# EasyEDA Pro project SimGEKI2_Core.epro, schematic Core New
Board Name: Core New Layout; Create Date: 2025-03-21; Page Name: P1; Project Name: ongeki-controller; Schematic Name: Core New; Update Date: 2025-04-17; Company: SimDevices; Page Size: A4; Version: v4.4
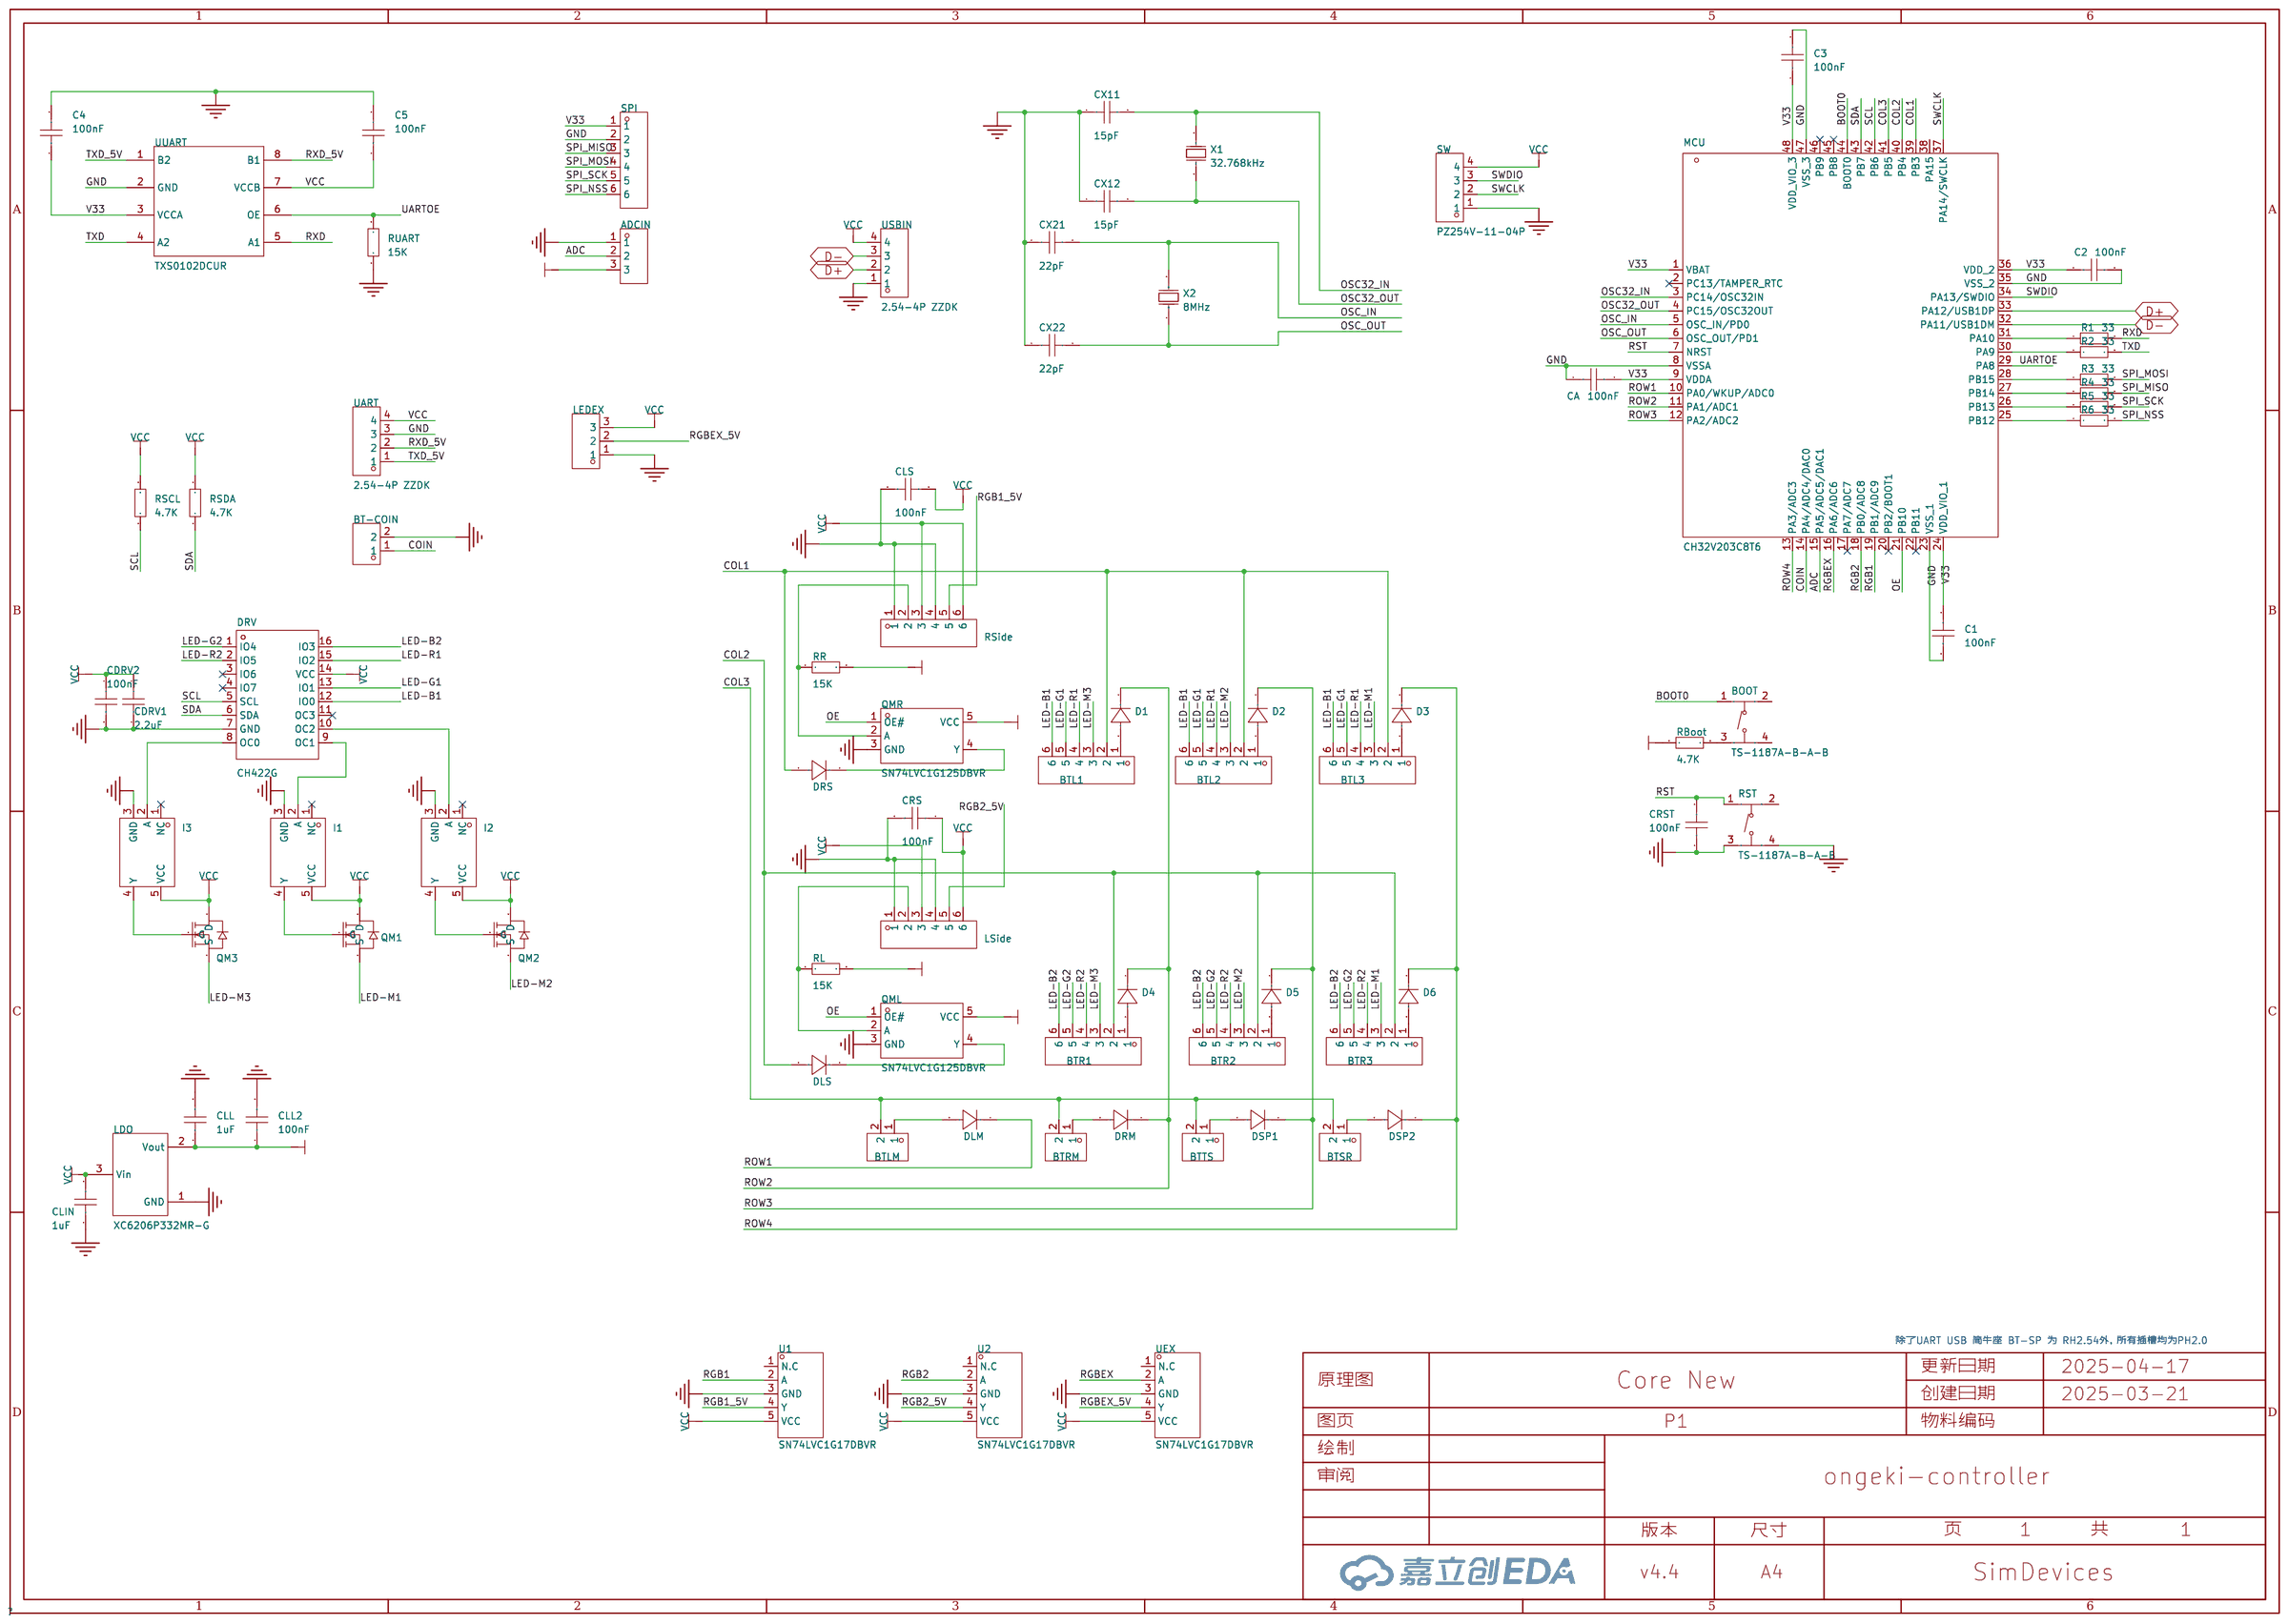
[diagram p0: schematic sheet]

## Parts
ADCIN  HDGC2001WV-3P  [CONN-TH_3P-P2.00_HDGC2001WV-3P]
BOOT  TS-1187A-B-A-B  [SW-SMD_4P-L5.1-W5.1-P3.70-LS6.5-TL_H1.5]
BT-COIN  ZX-XH2.54-2PZZ  [CONN-TH_2P-P2.50_HX25003-2A]
BTL1  HDGC2001WV-6P  [CONN-TH_6P-P2.00_HDGC2001WV-6P]
BTL2  HDGC2001WV-6P  [CONN-TH_6P-P2.00_HDGC2001WV-6P]
BTL3  HDGC2001WV-6P  [CONN-TH_6P-P2.00_HDGC2001WV-6P]
BTLM  ZX-XH2.54-2PZZ  [CONN-TH_2P-P2.50_HX25003-2A]
BTR1  HDGC2001WV-6P  [CONN-TH_6P-P2.00_HDGC2001WV-6P]
BTR2  HDGC2001WV-6P  [CONN-TH_6P-P2.00_HDGC2001WV-6P]
BTR3  HDGC2001WV-6P  [CONN-TH_6P-P2.00_HDGC2001WV-6P]
BTRM  ZX-XH2.54-2PZZ  [CONN-TH_2P-P2.50_HX25003-2A]
BTSR  ZX-XH2.54-2PZZ  [CONN-TH_2P-P2.50_HX25003-2A]
BTTS  ZX-XH2.54-2PZZ  [CONN-TH_2P-P2.50_HX25003-2A]
C1  100nF  [C0603]
C2  100nF  [C0603]
C3  100nF  [C0603]
C4  100nF  [C0603]
C5  100nF  [C0603]
CA  100nF  [C0603]
CDRV1  2.2uF  [C0603]
CDRV2  100nF  [C0603]
CLIN  1uF  [C0603]
CLL  1uF  [C0603]
CLL2  100nF  [C0603]
CLS  100nF  [C0603]
CRS  100nF  [C0603]
CRST  100nF  [C0603]
CX11  15pF  [C0603]
CX12  15pF  [C0603]
CX21  22pF  [C0603]
CX22  22pF  [C0603]
D1  1N4148W  [SOD-123FL_L2.8-W1.8-LS3.7-RD_CC1884540]
D2  1N4148W  [SOD-123FL_L2.8-W1.8-LS3.7-RD_CC1884540]
D3  1N4148W  [SOD-123FL_L2.8-W1.8-LS3.7-RD_CC1884540]
D4  1N4148W  [SOD-123FL_L2.8-W1.8-LS3.7-RD_CC1884540]
D5  1N4148W  [SOD-123FL_L2.8-W1.8-LS3.7-RD_CC1884540]
D6  1N4148W  [SOD-123FL_L2.8-W1.8-LS3.7-RD_CC1884540]
DLM  1N4148W  [SOD-123FL_L2.8-W1.8-LS3.7-RD_CC1884540]
DLS  1N4148W  [SOD-123FL_L2.8-W1.8-LS3.7-RD_CC1884540]
DRM  1N4148W  [SOD-123FL_L2.8-W1.8-LS3.7-RD_CC1884540]
DRS  1N4148W  [SOD-123FL_L2.8-W1.8-LS3.7-RD_CC1884540]
DRV  CH422G  [SOP-16_L10.0-W3.9-P1.27-LS6.0-BL]
DSP1  1N4148W  [SOD-123FL_L2.8-W1.8-LS3.7-RD_CC1884540]
DSP2  1N4148W  [SOD-123FL_L2.8-W1.8-LS3.7-RD_CC1884540]
I1  SN74LVC1G14DBVR  [SOT-23-5_L3.0-W1.7-P0.95-LS2.8-BR]
I2  SN74LVC1G14DBVR  [SOT-23-5_L3.0-W1.7-P0.95-LS2.8-BR]
I3  SN74LVC1G14DBVR  [SOT-23-5_L3.0-W1.7-P0.95-LS2.8-BR]
LDO  XC6206P332MR-G  [SOT-23-3_L2.9-W1.6-P1.90-LS2.8-BR]
LEDEX  HDGC2001WV-3P  [CONN-TH_3P-P2.00_HDGC2001WV-3P]
LSide  HDGC2001WV-6P  [CONN-TH_6P-P2.00_HDGC2001WV-6P]
MCU  CH32V203C8T6  [LQFP-48_L7.0-W7.0-P0.50-LS9.0-BL]
QM1  AO3400A  [SOT-23-3_L2.9-W1.3-P1.90-LS2.4-BR]
QM2  AO3400A  [SOT-23-3_L2.9-W1.3-P1.90-LS2.4-BR]
QM3  AO3400A  [SOT-23-3_L2.9-W1.3-P1.90-LS2.4-BR]
QML  SN74LVC1G125DBVR  [SOT-23-5_L3.0-W1.7-P0.95-LS2.8-BR]
QMR  SN74LVC1G125DBVR  [SOT-23-5_L3.0-W1.7-P0.95-LS2.8-BR]
R1  33  [R0402]
R2  33  [R0402]
R3  33  [R0402]
R4  33  [R0402]
R5  33  [R0402]
R6  33  [R0402]
RBoot  4.7K  [R0603]
RL  15K  [R0603]
RR  15K  [R0603]
RSCL  4.7K  [R0603]
RSDA  4.7K  [R0603]
RSide  HDGC2001WV-6P  [CONN-TH_6P-P2.00_HDGC2001WV-6P]
RST  TS-1187A-B-A-B  [SW-SMD_4P-L5.1-W5.1-P3.70-LS6.5-TL_H1.5]
RUART  15K  [R0603]
SPI  HDGC2001WV-6P  [CONN-TH_6P-P2.00_HDGC2001WV-6P]
SW  PZ254V-11-04P  [HDR-TH_4P-P2.54-V-M]
U1  SN74LVC1G17DBVR  [SOT-23-5_L3.0-W1.7-P0.95-LS2.8-BR]
U2  SN74LVC1G17DBVR  [SOT-23-5_L3.0-W1.7-P0.95-LS2.8-BR]
UART  2.54-4P ZZDK  [HDR-TH_4P-P2.50-V-F-2]
UEX  SN74LVC1G17DBVR  [SOT-23-5_L3.0-W1.7-P0.95-LS2.8-BR]
USBIN  2.54-4P ZZDK  [HDR-TH_4P-P2.50-V-F-2]
UUART  TXS0102DCUR  [VSSOP-8_L2.4-W2.1-P0.50-LS3.2-BR]
X1  32.768kHz  [CRYSTAL-SMD_L3.2-W1.5-1]
X2  8MHz  [CRYSTAL-SMD_L5.0-W3.2]

## Library data of the parts
ADCIN LEDEX = HDGC2001WV-3P: LCSC Part Name: PH2.0直针 3P; Supplier Part: C5175231; Manufacturer: HDGC(华德共创); Supplier Footprint: 插件,P=2mm; JLCPCB Part Class: 扩展库; Datasheet: https://atta.szlcsc.com/upload/public/pdf/source/20220916/C6875813FFA1039A4B3E585D63AEFA0D.pdf; Supplier: LCSC
BOOT RST = TS-1187A-B-A-B: 电路结构:单刀单掷;按钮形状:圆形按钮;作用力:160gf;安装方式:立贴;开关长度:5.1mm;开关宽度:5.1mm;开关高度:1.5mm;带支架:不带;触点电流:50mA;额定电压(DC):12V;绝缘电阻:-;带灯:无;机械寿命:10万次;; LCSC Part Name: 5.1*5.1*1.5mm 立贴 轻触开关; Supplier Part: C318884; Manufacturer: XKB Connectivity(中国星坤); Supplier Footprint: SMD; JLCPCB Part Class: Basic Part; Datasheet: https://atta.szlcsc.com/upload/public/pdf/source/20200227/C318890_053E50208A88A7BA1965D8746000774E.pdf; Supplier: LCSC; Circuit: 单刀单掷; Actuator Style: 圆形按钮; Operating Force: 160gf; Mounting Style: 立贴; Switch Length: 5.1mm; Switch Width: 5.1mm; Switch Height: 1.5mm; Strike Gundam: 不带; Contact Current: 50mA; Voltage Rating (DC): 12V; Actuator/Cap Color: 金色; With Lamp: 无; Mechanical Life: 10万次; Operating Temperature: -30℃~+85℃
BT-COIN BTLM BTRM BTSR BTTS = ZX-XH2.54-2PZZ: 插针结构:1x2P;间距:2.54mm;安装方式:直插;参考系列:XH;总PIN数:2P;排数:1;每排PIN数:2;行距:-;额定电流:3A;触头材质:黄铜;触头镀层:锡;工作温度范围:-25℃~+85℃;; Supplier Part: C7429632; Manufacturer: Megastar(兆星); Supplier Footprint: 插件,P=2.54mm; JLCPCB Part Class: Extended Part; Datasheet: https://atta.szlcsc.com/upload/public/pdf/source/20230619/19BA6947230AA44A04D3EDD65E618FD0.pdf; Supplier: LCSC; Pins Structure: 1x2P; Pitch: 2.54mm; Mounting Style: 直插; Reference Series: XH; Number of Pins: 2P; Number of Rows: 1; Number of PINs Per Row: 2; Current Rating (Max): 3A; Contact Material: 黄铜; Contact Plating: 锡; Operating Temperature Range: -25℃~+85℃
BTL1-BTL3 BTR1-BTR3 LSide RSide SPI = HDGC2001WV-6P: LCSC Part Name: PH2.0直针 6P; Supplier Part: C5175234; Manufacturer: HDGC(华德共创); Supplier Footprint: 插件,P=2mm; JLCPCB Part Class: 扩展库; Datasheet: https://atta.szlcsc.com/upload/public/pdf/source/20220916/C6875813FFA1039A4B3E585D63AEFA0D.pdf; Supplier: LCSC
C1 C3-C5 CA CLIN CLL CLL2 CRST CX11 CX12 CX21 CX22 = CAP_0603: Supplier Footprint: 0603
C2 = CAP_0603: Supplier Footprint: 0402
CDRV1 = CL10A225KO8NNNC: 容值:2.2uF;精度:±10%;额定电压:16V;材质(温度系数):X5R;; LCSC Part Name: 2.2uF ±10% 16V; Supplier Part: C23630; Manufacturer: SAMSUNG(三星); Supplier Footprint: 0603; JLCPCB Part Class: Basic Part; Datasheet: https://atta.szlcsc.com/upload/public/pdf/source/20160103/1457707709512.pdf; Supplier: LCSC; Tolerance: ±10%; Voltage Rated: 16V; Temperature Coefficient: X5R
CDRV2 CLS CRS = CC0603KRX7R9BB104: 容值:100nF;精度:±10%;额定电压:50V;材质(温度系数):X7R;; LCSC Part Name: 100nF ±10% 50V; Supplier Part: C14663; Manufacturer: YAGEO(国巨); Supplier Footprint: 0603; JLCPCB Part Class: Basic Part; Datasheet: https://atta.szlcsc.com/upload/public/pdf/source/20180910/C282072_33301C7F631E79921B82A8DAC6BCC5B3.pdf; Supplier: LCSC; Tolerance: ±10%; Voltage Rated: 50V; Temperature Coefficient: X7R
D1-D6 DLM DLS DRM DRS DSP1 DSP2 = 1N4148W_C81598: 二极管配置:独立式;正向压降(Vf):1V@50mA;直流反向耐压(Vr):75V;平均整流电流(Io):150mA;功率:400mW;反向恢复时间(trr):4ns;; LCSC Part Name: 电压:75V 电流:150mA; Supplier Part: C81598; Manufacturer: ST(先科); Supplier Footprint: SOD-123; JLCPCB Part Class: Basic Part; Datasheet: https://atta.szlcsc.com/upload/public/pdf/source/20161024/1477288446905.pdf; Supplier: LCSC; Diode Configuration: 独立式; Forward Voltage (Vf@If): 1V@50mA; Reverse Voltage (Vr): 75V; Average Rectified Current (Io): 150mA; Power Dissipation: 400mW; Reverse Leakage Current: 1uA@75V; Reverse Recovery Time (trr): 4ns
DRV = CH422G: 接口:I2C；SPI;I/O数量:8;时钟频率:1MHz;; LCSC Part Name: 数码管显示驱动及 I/O 扩展芯片; Supplier Part: C57543; Manufacturer: WCH(南京沁恒); Supplier Footprint: SOP-16; JLCPCB Part Class: Extended Part; Datasheet: https://atta.szlcsc.com/upload/public/pdf/source/20170818/C57543_1503051309697895383.PDF; Supplier: LCSC; Interface: I2C；SPI; Number of I/O: 8; Interrupt Output: 无中断输出; Output Type: 推挽式; Clock Frequency: 1MHz; Supply Voltage: 3V~5V; Operating Temperature: -40℃~+85℃; Diode Configuration: 独立式; Forward Voltage (Vf@If): 1V@50mA; Reverse Voltage (Vr): 75V; Average Rectified Current (Io): 150mA; Power Dissipation: 400mW; Reverse Leakage Current: 1uA@75V; Reverse Recovery Time (trr): 4ns
I1-I3 = SN74LVC1G14DBVR_C434069: 逻辑电路的归属系列:-;逻辑类型:-;电路/元件数:-;输入数/每元件位数:-;电源电压:-;静态电流（最大值）:-;; LCSC Part Name: 门极和反相器; Supplier Part: C434069; Manufacturer: UMW(广东友台半导体); Supplier Footprint: SOT-23-5; JLCPCB Part Class: Extended Part; Datasheet: https://atta.szlcsc.com/upload/public/pdf/source/20190930/C434069_601D37537AF749E7095B833416EB8C97.pdf; Supplier: LCSC
LDO = XC6206P332MR-G_C5446: 输出类型:固定;最大输入电压:6V;输出电压:3.3V;最大输出电流:200mA;电源纹波抑制比(PSRR):-;输出极性:正极;; LCSC Part Name: 输入6V 输出3.3V 200mA; Supplier Part: C5446; Manufacturer: TOREX(特瑞仕); Supplier Footprint: SOT-23-3L; JLCPCB Part Class: 基础库; Datasheet: https://atta.szlcsc.com/upload/public/pdf/source/20130823/1457706639850.pdf; Supplier: LCSC; Output Type: 固定; Maximum Input Voltage: 6V; Output Voltage: 3.3V; MAX Output Current: 200mA; Dropout Voltage: 680mV@(100mA); Output Polarity: 正极; Number of Outputs: 1
MCU = CH32V203C8T6: CPU内核:RISC-V;程序存储容量:64KB;RAM总容量:20KB;GPIO端口数量:-;工作电压范围:-;CPU最大主频:144MHz;程序存储器类型:FLASH;; Supplier Part: C3001172; Manufacturer: WCH(南京沁恒); Supplier Footprint: LQFP-48(7x7); JLCPCB Part Class: 扩展库; Datasheet: https://atta.szlcsc.com/upload/public/pdf/source/20220425/D3E728E801B9982E2758AC225E3A30F9.pdf; Supplier: LCSC; CPU Core: RISC-V; Program Storage Size: 64KB; RAM Size: 20KB; CPU Maximum Speed: 144MHz; Program Memory Type: FLASH
QM1-QM3 = AO3400A_C20917: 类型:N沟道;漏源电压(Vdss):30V;连续漏极电流(Id):5.7A;功率(Pd):1.4W;导通电阻(RDS(on)@Vgs,Id):26.5mΩ@10V,5.7A;; LCSC Part Name: N沟道 30V 5.7A; Supplier Part: C20917; Manufacturer: AOS; Supplier Footprint: SOT-23-3L; JLCPCB Part Class: Basic Part; Datasheet: https://atta.szlcsc.com/upload/public/pdf/source/20140107/1457706668533.pdf; Supplier: LCSC; Type: N沟道; Drain Source Voltage (Vdss): 30V; Continuous Drain Current (Id): 5.7A; Power Dissipation (Pd): 1.4W; Drain Source On Resistance (RDS(on)@Vgs,Id): 26.5mΩ@10V,5.7A; Gate Threshold Voltage (Vgs(th)@Id): 1.5V@250uA
QML QMR = SN74LVC1G125DBVR: 电源电压:1.65V~5.5V;元件数:1;每个元件位数:1;灌电流(IOL):32mA;拉电流(IOH):32mA;; Supplier Part: C23654; Manufacturer: TI(德州仪器); Supplier Footprint: SOT-23-5; JLCPCB Part Class: Extended Part; Datasheet: http://www.ti.com/cn/lit/gpn/sn74lvc1g125; Supplier: LCSC; output type: 三态; Supply Voltage: 1.65V~5.5V; Number of Elements: 1; Number of Bits per Element: 1; Sink Current: 32mA; Source Current: 32mA; Logic Family: 74LVC; Operating Temperature: -40℃~+125℃
R1-R6 = Res_0402: Supplier Footprint: 0402
RBoot RL RR RSCL RSDA RUART = Res_0603: Supplier Footprint: 0603
SW = PZ254V-11-04P: 插针结构:1x4P;间距:2.54mm;行距:-;圆针/方针:方针;安装类型:直插;排数:单排;总PIN位数:4P;额定电流:3A;额定电压:250V;配合针长度:6mm;塑高:2.5mm;端接针长度:3mm;触头材质:-;工作温度范围:-40℃~+105℃;颜色:黑色;; LCSC Part Name: 间距:2.54mm 1x4P 直插 方针; Supplier Part: C2691448; Manufacturer: XFCN(兴飞); Supplier Footprint: 插件,P=2.54mm; JLCPCB Part Class: 扩展库; Datasheet: https://atta.szlcsc.com/upload/public/pdf/source/20200309/C492403_F9F19131791D08044AD4F84F8E751A34.pdf; Supplier: LCSC; Pin Structure: 1x4P; Pitch: 2.54mm; Circluar Pins/Square Pins: 方针; Mounting Type: 直插; Number of Rows: 单排; Number of Pins: 4P; Current Rating (Max): 3A; Voltage Rating (Max): 250V; Length of Mating Pin: 6mm; Insulation Height: 2.5mm; Length of End Connection Pin: 3mm; Operating Temperature Range: -40℃~+105℃; Color: 黑色
U1 U2 UEX = SN74LVC1G17DBVR: 输入类型:施密特触发器;电源电压:1.65V~5.5V;元件数:1;每个元件位数:1;灌电流(IOL):32mA;拉电流(IOH):32mA;; Supplier Part: C7836; Manufacturer: TI(德州仪器); Supplier Footprint: SOT-23-5; JLCPCB Part Class: 扩展库; Datasheet: https://www.ti.com/cn/lit/gpn/sn74lvc1g17; Supplier: LCSC; Input type: 施密特触发器; output type: 推挽; Supply Voltage: 1.65V~5.5V; Number of Elements: 1; Number of Bits per Element: 1; Sink Current: 32mA; Source Current: 32mA; Logic Family: 74LVC; Operating Temperature: -40℃~+125℃
UART USBIN = 2.54-4P ZZDK: 插针结构:1x4P;间距:2.5mm;安装方式:直插;参考系列:XH;总PIN数:4P;排数:1;每排PIN数:4;额定电流:3A;触头材质:黄铜;触头镀层:锡;工作温度范围:-25℃~+85℃;; LCSC Part Name: 1x4P 间距:2.5mm 直插 系列:XH 白色; Supplier Part: C18185651; Manufacturer: SHOU HAN(首韩); Supplier Footprint: 插件,P=2.5mm; JLCPCB Part Class: 扩展库; Datasheet: https://atta.szlcsc.com/upload/public/pdf/source/20230919/5CCBE7408303C792D3A62491FEFF5508.pdf; Supplier: LCSC; Pins Structure: 1x4P; Pitch: 2.5mm; Mounting Style: 直插; Reference Series: XH; Number of Pins: 4P; Number of Rows: 1; Number of PINs Per Row: 4; Current Rating (Max): 3A; Contact Material: 黄铜; Contact Plating: 锡; Operating Temperature Range: -25℃~+85℃
UUART = TXS0102DCUR: 数据速率:24Mbps;电压(VCCA):1.65V~3.6V;电压(VCCB):2.3V~5.5V;电路数:1;每个电路通道数:2;; LCSC Part Name: 24Mbps 2位双向电平转换器; Supplier Part: C53434; Manufacturer: TI(德州仪器); Supplier Footprint: VSSOP-8; JLCPCB Part Class: Extended Part; Datasheet: https://www.ti.com/cn/lit/gpn/txs0102; Supplier: LCSC; Channel Type: 双向; Data Rate: 24Mbps; Supply Voltage (VCCA): 1.65V~3.6V; Supply Voltage (VCCB): 2.3V~5.5V; Number of Circuits: 1; Channels per Circuit: 2; Output Type: 开路漏极；推挽式; Operating Temperature: -40℃~+85℃; Features: 自动方向检测
X1 = XKXGI-SUA-32.768K: 晶振类型:贴片晶振;频率:32.768kHz;常温频差:±20ppm;负载电容:12.5pF;频率稳定度:±30ppm;; LCSC Part Name: 32.768kHz ±20ppm 12.5pF; Supplier Part: C5213671; Manufacturer: YXC(扬兴晶振); Supplier Footprint: SMD3215-2P; JLCPCB Part Class: Extended Part; Datasheet: https://atta.szlcsc.com/upload/public/pdf/source/20240329/3A7650FD985DD0DE85694D3785AB4916.pdf; Supplier: LCSC; Type: 贴片晶振; Normal temperature Frequency Tolerance: ±20ppm; Load Capacitance: 12.5pF; Frequency Stability: ±30ppm; Operating Temperature: -40℃~+85℃
X2 = XG1EL89CSI-111YLC-8M: 晶振类型:贴片晶振;频率:8MHz;常温频差:±10ppm;负载电容:20pF;频率稳定度:±20ppm;; LCSC Part Name: 8MHz ±10ppm 20pF; Supplier Part: C5280575; Manufacturer: YXC(扬兴晶振); Supplier Footprint: SMD5032; JLCPCB Part Class: Extended Part; Datasheet: https://atta.szlcsc.com/upload/public/pdf/source/20240329/44922B0AF7B60E58E9B66993B6077277.pdf; Supplier: LCSC; Type: 贴片晶振; Normal temperature Frequency Tolerance: ±10ppm; Load Capacitance: 20pF; Frequency Stability: ±20ppm; Operating Temperature: -40℃~+85℃

## Nets
GND: ADCIN.1 BT-COIN.2 C1.2 C2.2 C3.2 C4.2 C5.2 CA.1 CDRV1.2 CDRV2.2 CLIN.1 CLL.2 CLL2.2 CLS.2 CRS.2 CRST.1 CX11.1 CX12.1 CX21.1 CX22.1 DRV.7(GND) I1.3(GND) I2.3(GND) I3.3(GND) LDO.1(GND) LEDEX.1 LSide.1 LSide.4 MCU.8(VSSA) MCU.23(VSS_1) MCU.35(VSS_2) MCU.47(VSS_3) QML.3(GND) QMR.3(GND) RSide.1 RSide.4 RST.3(C) RST.4(D) RUART.1 SPI.2 SW.1 U1.3(GND) U2.3(GND) UART.3 UEX.3(GND) USBIN.1 UUART.2(GND)
V33: ADCIN.3 C1.1 C2.1 C3.1 C4.1 CA.2 CLL.1 CLL2.1 LDO.2(Vout) MCU.1(VBAT) MCU.9(VDDA) MCU.24(VDD_VIO_1) MCU.36(VDD_2) MCU.48(VDD_VIO_3) QML.5(VCC) QMR.5(VCC) RBoot.1 RL.2 RR.2 SPI.1 UUART.3(VCCA)
VCC: C5.1 CDRV1.1 CDRV2.1 CLIN.2 CLS.1 CRS.1 DRV.14(VCC) I1.5(VCC) I2.5(VCC) I3.5(VCC) LDO.3(Vin) LEDEX.3 LSide.3 LSide.6 QM1.3(D) QM2.3(D) QM3.3(D) RSCL.2 RSDA.2 RSide.3 RSide.6 SW.4 U1.5(VCC) U2.5(VCC) UART.4 UEX.5(VCC) USBIN.4 UUART.7(VCCB)
ADC: ADCIN.2 MCU.15(PA5/ADC5/DAC1)
BOOT0: BOOT.1(A) MCU.44(BOOT0)
COIN: BT-COIN.1 MCU.14(PA4/ADC4/DAC0)
COL1: BTL1.2 BTL2.2 BTL3.2 DRS.2(A) MCU.39(PB3)
COL2: BTR1.2 BTR2.2 BTR3.2 DLS.2(A) MCU.40(PB4)
COL3: BTLM.2 BTRM.2 BTSR.2 BTTS.2 MCU.41(PB5)
D+: MCU.33(PA12/USB1DP) USBIN.2
D-: MCU.32(PA11/USB1DM) USBIN.3
LED-B1: BTL1.6 BTL2.6 BTL3.6 DRV.12(IO0)
LED-B2: BTR1.6 BTR2.6 BTR3.6 DRV.16(IO3)
LED-G1: BTL1.5 BTL2.5 BTL3.5 DRV.13(IO1)
LED-G2: BTR1.5 BTR2.5 BTR3.5 DRV.1(IO4)
LED-M1: BTL3.3 BTR3.3 QM1.2(S)
LED-M2: BTL2.3 BTR2.3 QM2.2(S)
LED-M3: BTL1.3 BTR1.3 QM3.2(S)
LED-R1: BTL1.4 BTL2.4 BTL3.4 DRV.15(IO2)
LED-R2: BTR1.4 BTR2.4 BTR3.4 DRV.2(IO5)
OE: MCU.21(PB10) QML.1(OE#) QMR.1(OE#)
OSC32_IN: CX11.2 MCU.3(PC14/OSC32IN) X1.2(OSC2)
OSC32_OUT: CX12.2 MCU.4(PC15/OSC32OUT) X1.1(OSC1)
OSC_IN: CX21.2 MCU.5(OSC_IN/PD0) X2.2(OSC2)
OSC_OUT: CX22.2 MCU.6(OSC_OUT/PD1) X2.1(OSC1)
RGB1: MCU.19(PB1/ADC9) U1.2(A)
RGB1_5V: RSide.5 U1.4(Y)
RGB2: MCU.18(PB0/ADC8) U2.2(A)
RGB2_5V: LSide.5 U2.4(Y)
RGBEX: MCU.16(PA6/ADC6) UEX.2(A)
RGBEX_5V: LEDEX.2 UEX.4(Y)
ROW1: DLM.1(K) MCU.10(PA0/WKUP/ADC0)
ROW2: D1.1(K) D4.1(K) DRM.1(K) MCU.11(PA1/ADC1)
ROW3: D2.1(K) D5.1(K) DSP1.1(K) MCU.12(PA2/ADC2)
ROW4: D3.1(K) D6.1(K) DSP2.1(K) MCU.13(PA3/ADC3)
RST: CRST.2 MCU.7(NRST) RST.1(A)
RXD: R1.2 UUART.5(A1)
RXD_5V: UART.2 UUART.8(B1)
SCL: DRV.5(SCL) MCU.42(PB6) RSCL.1
SDA: DRV.6(SDA) MCU.43(PB7) RSDA.1
SPI_MISO: R4.2 SPI.3
SPI_MOSI: R3.2 SPI.4
SPI_NSS: R6.2 SPI.6
SPI_SCK: R5.2 SPI.5
SWCLK: MCU.37(PA14/SWCLK) SW.2
SWDIO: MCU.34(PA13/SWDIO) SW.3
TXD: R2.2 UUART.4(A2)
TXD_5V: UART.1 UUART.1(B2)
UARTOE: MCU.29(PA8) RUART.2 UUART.6(OE)
$1N8822: BTLM.1 DLM.2(A)
$1N8852: BTRM.1 DRM.2(A)
$1N8879: BTTS.1 DSP1.2(A)
$1N30918: DRV.8(OC0) I3.2(A)
$1N30924: I3.4(Y) QM3.1(G)
$1N31005: I1.4(Y) QM1.1(G)
$1N31012: DRV.9(OC1) I1.2(A)
$1N31263: I2.4(Y) QM2.1(G)
$1N31270: DRV.10(OC2) I2.2(A)
$1N35496: BTR1.1 D4.2(A)
$1N35725: QMR.2(A) RR.1 RSide.2
$1N35967: LSide.2 QML.2(A) RL.1
$1N37620: BTL1.1 D1.2(A)
$1N37739: BTL2.1 D2.2(A)
$1N37949: BTL3.1 D3.2(A)
$1N38201: BTR2.1 D5.2(A)
$1N38293: BTR3.1 D6.2(A)
$1N38438: BTSR.1 DSP2.2(A)
$1N42496: DRS.1(K) QMR.4(Y)
$1N42591: DLS.1(K) QML.4(Y)
$1N43093: BOOT.3(C) RBoot.2
$1N65972: MCU.31(PA10) R1.1
$1N66002: MCU.30(PA9) R2.1
$1N66032: MCU.28(PB15) R3.1
$1N66062: MCU.27(PB14) R4.1
$1N66092: MCU.26(PB13) R5.1
$1N66122: MCU.25(PB12) R6.1

Not connected (* = marked no-connect by the designer): BOOT 2(B) 4(D); DRV 3(IO6)* 4(IO7)* 11(OC3)*; I1 1(NC)*; I2 1(NC)*; I3 1(NC)*; MCU 2(PC13/TAMPER_RTC)* 17(PA7/ADC7)* 20(PB2/BOOT1)* 22(PB11)* 38(PA15) 45(PB8)* 46(PB9)*; RST 2(B); U1 1(N.C); U2 1(N.C); UEX 1(N.C)

## Notes on the sheet
- 除了UART USB 简牛座 BT-SP 为 RH2.54外，所有插槽均为PH2.0
